# Altium schematic sheet CBCM PCB Rev 1.SchDoc
size A3
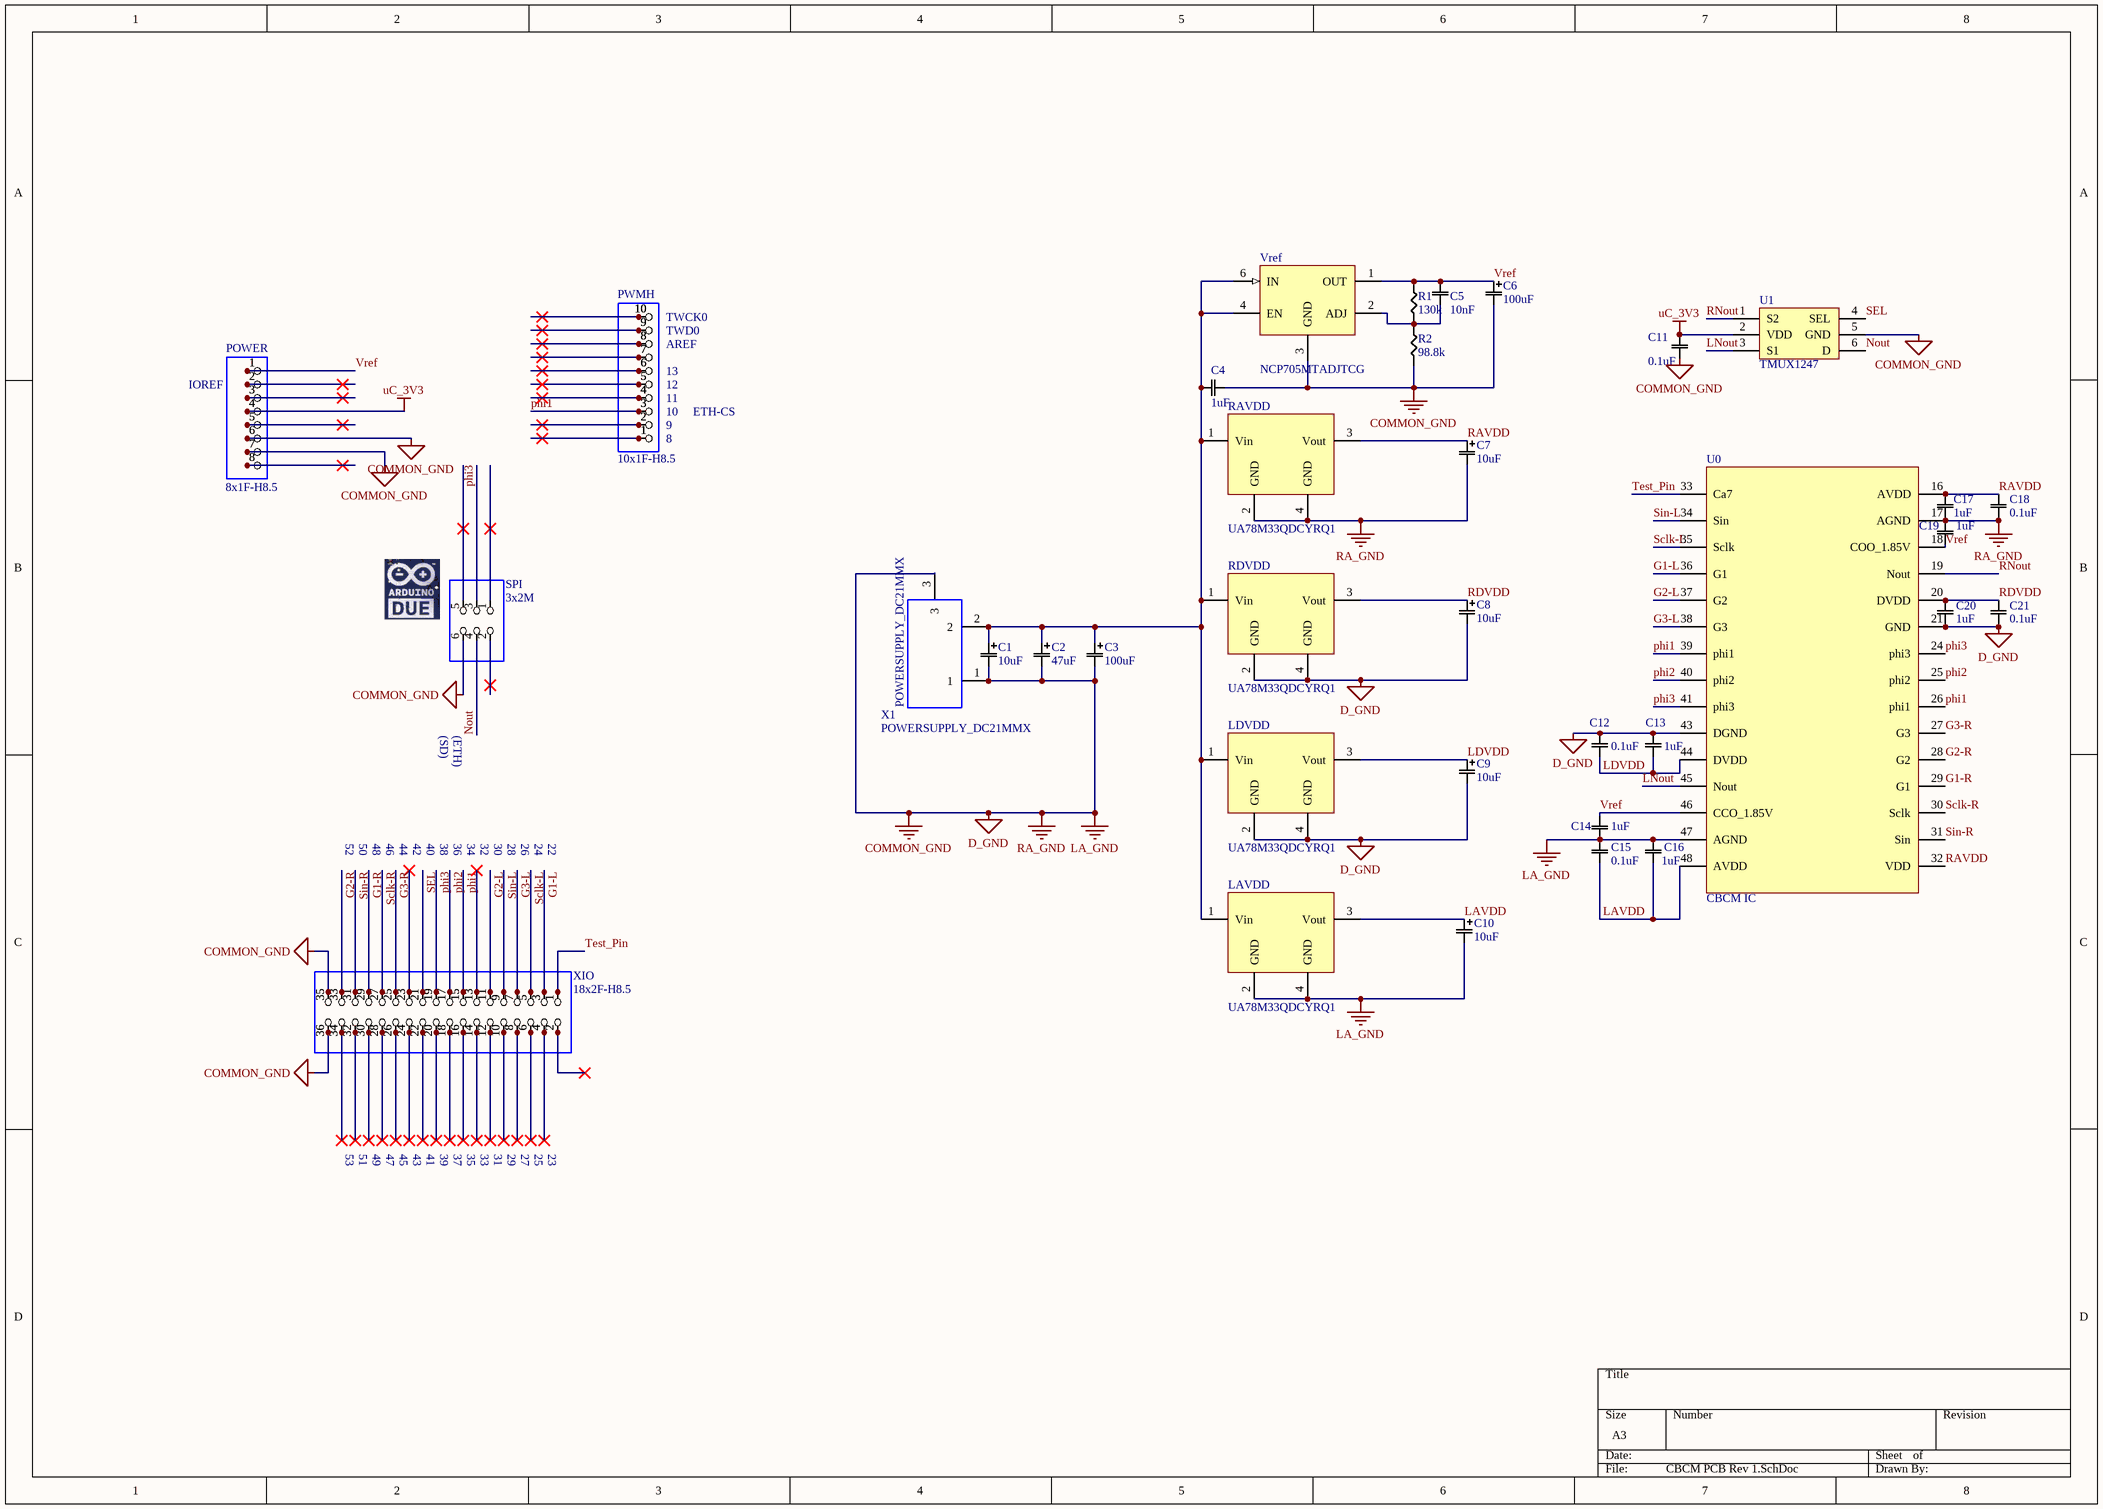
[diagram p0: CBCM PCB Rev 1.SchDoc]

## Parts
C1  10uF  [CAPAE4643X55M]
C2  47uF  [CAPAE4643X55M]
C3  100uF  [CAPAE7066X77M]
C4  1uF  [CAPC1608X09N]
C5  10nF  [CAPC1608X09N]
C6  100uF  [CAPAE7066X77M]
C7  10uF  [CAPAE4643X55M]
C8  10uF  [CAPAE4643X55M]
C9  10uF  [CAPAE4643X55M]
C10  10uF  [CAPAE4643X55M]
C11  0.1uF  [CAPC1608X09N]
C12  0.1uF  [CAPC1608X09N]
C13  1uF  [CAPC1608X09N]
C14  1uF  [CAPC1608X09N]
C15  0.1uF  [CAPC1608X09N]
C16  1uF  [CAPC1608X09N]
C17  1uF  [CAPC1608X09N]
C18  0.1uF  [CAPC1608X09N]
C19  1uF  [CAPC1608X09N]
C20  1uF  [CAPC1608X09N]
C21  0.1uF  [CAPC1608X09N]
LAVDD  UA78M33QDCYRQ1  [SOT230P700X180-4N]
LDVDD  UA78M33QDCYRQ1  [SOT230P700X180-4N]
POWER  8x1F-H8.5  [1X08]
PWMH  10x1F-H8.5  [1X10]
R1  130k  [RESC1608X09N]
R2  98.8k  [RESC1608X09N]
RAVDD  UA78M33QDCYRQ1  [SOT230P700X180-4N]
RDVDD  UA78M33QDCYRQ1  [SOT230P700X180-4N]
SPI  3x2M  [2X03]
U0  CBCM IC  [PGA85x11]
U1  TMUX1247  [TSOP65P210X110-6N]
Vref  NCP705MTADJTCG  [WDFN6]
X1  POWERSUPPLY_DC21MMX  [POWERSUPPLY_DC-21MM]
XIO  18x2F-H8.5  [2X18]

## Nets
COMMON_GND: C1.2(Terminal_2) C2.2(Terminal_2) C3.2(Terminal_2) C4.2(Terminal_2) C6.2(Terminal_2) C7.2(Terminal_2) C8.2(Terminal_2) C9.2(Terminal_2) C10.2(Terminal_2) C11.1(Terminal_0) C12.2(Terminal_2) C13.2(Terminal_2) C14.1(Terminal_0) C15.2(Terminal_2) C16.2(Terminal_2) C17.1(Terminal_0) C18.1(Terminal_0) C19.2(Terminal_2) C20.1(Terminal_0) C21.1(Terminal_0) LAVDD.2(GND) LAVDD.4(GND) LDVDD.2(GND) LDVDD.4(GND) POWER.6 POWER.7 R2.1(Terminal_1) RAVDD.2(GND) RAVDD.4(GND) RDVDD.2(GND) RDVDD.4(GND) SPI.6 U0.17(AGND) U0.21(GND) U0.43(DGND) U0.47(AGND) U1.5(GND) Vref.3(GND) X1.1 X1.3 XIO.35 XIO.36  [also labelled D_GND, LA_GND, RA_GND]
uC_3V3: C11.2(Terminal_2) POWER.4 U1.2(VDD)
G1-L: U0.36(G1) XIO.3
G1-R: U0.29(G1) XIO.29
G2-L: U0.37(G2) XIO.11
G2-R: U0.28(G2) XIO.33
G3-L: U0.38(G3) XIO.7
G3-R: U0.27(G3) XIO.25
LAVDD: C10.1(Terminal_0) C15.1(Terminal_0) C16.1(Terminal_0) LAVDD.3(Vout) U0.48(AVDD)
LDVDD: C9.1(Terminal_0) C12.1(Terminal_0) C13.1(Terminal_0) LDVDD.3(Vout) U0.44(DVDD)
LNout: U0.45(Nout) U1.3(S1)
Nout: SPI.4 U1.6(D)
phi1: PWMH.3 U0.26(phi1) U0.39(phi1) XIO.15
phi2: U0.25(phi2) U0.40(phi2) XIO.17
phi3: SPI.3 U0.24(phi3) U0.41(phi3) XIO.19
RAVDD: C7.1(Terminal_0) C17.2(Terminal_2) C18.2(Terminal_2) RAVDD.3(Vout) U0.16(AVDD) U0.32(VDD)
RDVDD: C8.1(Terminal_0) C20.2(Terminal_2) C21.2(Terminal_2) RDVDD.3(Vout) U0.20(DVDD)
RNout: U0.19(Nout) U1.1(S2)
Sclk-L: U0.35(Sclk) XIO.5
Sclk-R: U0.30(Sclk) XIO.27
SEL: U1.4(SEL) XIO.21
Sin-L: U0.34(Sin) XIO.9
Sin-R: U0.31(Sin) XIO.31
Test_Pin: U0.33(Ca7) XIO.1
Vref: C5.2(Terminal_2) C6.1(Terminal_0) C14.2(Terminal_2) C19.1(Terminal_0) POWER.1 R1.2(Terminal_2) U0.18(COO_1.85V) U0.46(CCO_1.85V) Vref.1(OUT)
NetC1_1: C1.1(Terminal_0) C2.1(Terminal_0) C3.1(Terminal_0) C4.1(Terminal_0) LAVDD.1(Vin) LDVDD.1(Vin) RAVDD.1(Vin) RDVDD.1(Vin) Vref.4(EN) Vref.6(IN) X1.2
NetC5_1: C5.1(Terminal_0) R1.1(Terminal_1) R2.2(Terminal_2) Vref.2(ADJ)

Not connected (* = marked no-connect by the designer): POWER 2* 3* 5* 8*; PWMH 1* 2* 4* 5* 6* 7* 8* 9* 10*; SPI 1* 2* 5*; XIO 2* 4* 6* 8* 10* 12* 13* 14* 16* 18* 20* 22* 23* 24* 26* 28* 30* 32* 34*

## Notes on the sheet
- (near PWMH) TWCK0
- (near POWER) IOREF
- (near PWMH) 12
- (near PWMH) 13
- (near PWMH) TWD0
- (near PWMH) AREF
- (near PWMH) 8
- (near PWMH) 9
- (near PWMH) 10
- (near PWMH) 11
- (near PWMH) ETH-CS
- (SD)
- (ETH)
- 52
- 50
- 48
- 46
- 44
- 42
- 40
- 38
- 36
- 34
- 32
- 30
- 28
- 26
- 24
- 22
- 53
- 51
- 49
- 47
- 45
- 43
- 41
- 39
- 37
- 35
- 33
- 31
- 29
- 27
- 25
- 23

## Library data of the parts
C1 C2 C7-C10 = Electrolytic_CAP(4.0x5.5)
C3 C6 = Electrolytic_CAP(6.3x7.7)
C4 C5 C11-C21 = CAP0603
POWER = PINHD-1X8
PWMH = PINHD-1X10
R1 R2 = RES0603
SPI = PINHD-2X3
U0 = CBCM IC: pin to pad: 16>H1 17>H2 18>J1 19>K1 20>J2 21>L1 24>L2 25>L3 26>K4 27>L4 28>J5 29>K5 30>L5 31>K6 32>J6 33>J7 34>L7 35>K7 36>L6 37>L8 38>K8 39>L9 40>L10 41>K9 43>K10 44>J10 45>K11 46>J11 47>H10 48>H11
Vref = NCP705MTADJTCG: 500 mA, Ultra-Low  Quiescent Current, IQ 13 A,  Ultra-Low Noise, LDO  Voltage Regulator; Manufacturer: ON Semiconductor; Manufacturer Part Number: NCP705MTADJTCG; Digi-Key link: https://www.digikey.ca/product-detail/en/on-semiconductor/NCP705MTADJTCG/NCP705MTADJTCGOSCT-ND/8538627
XIO = PINHD-2X18